# Altium project Z380-Z20X.PrjPcb
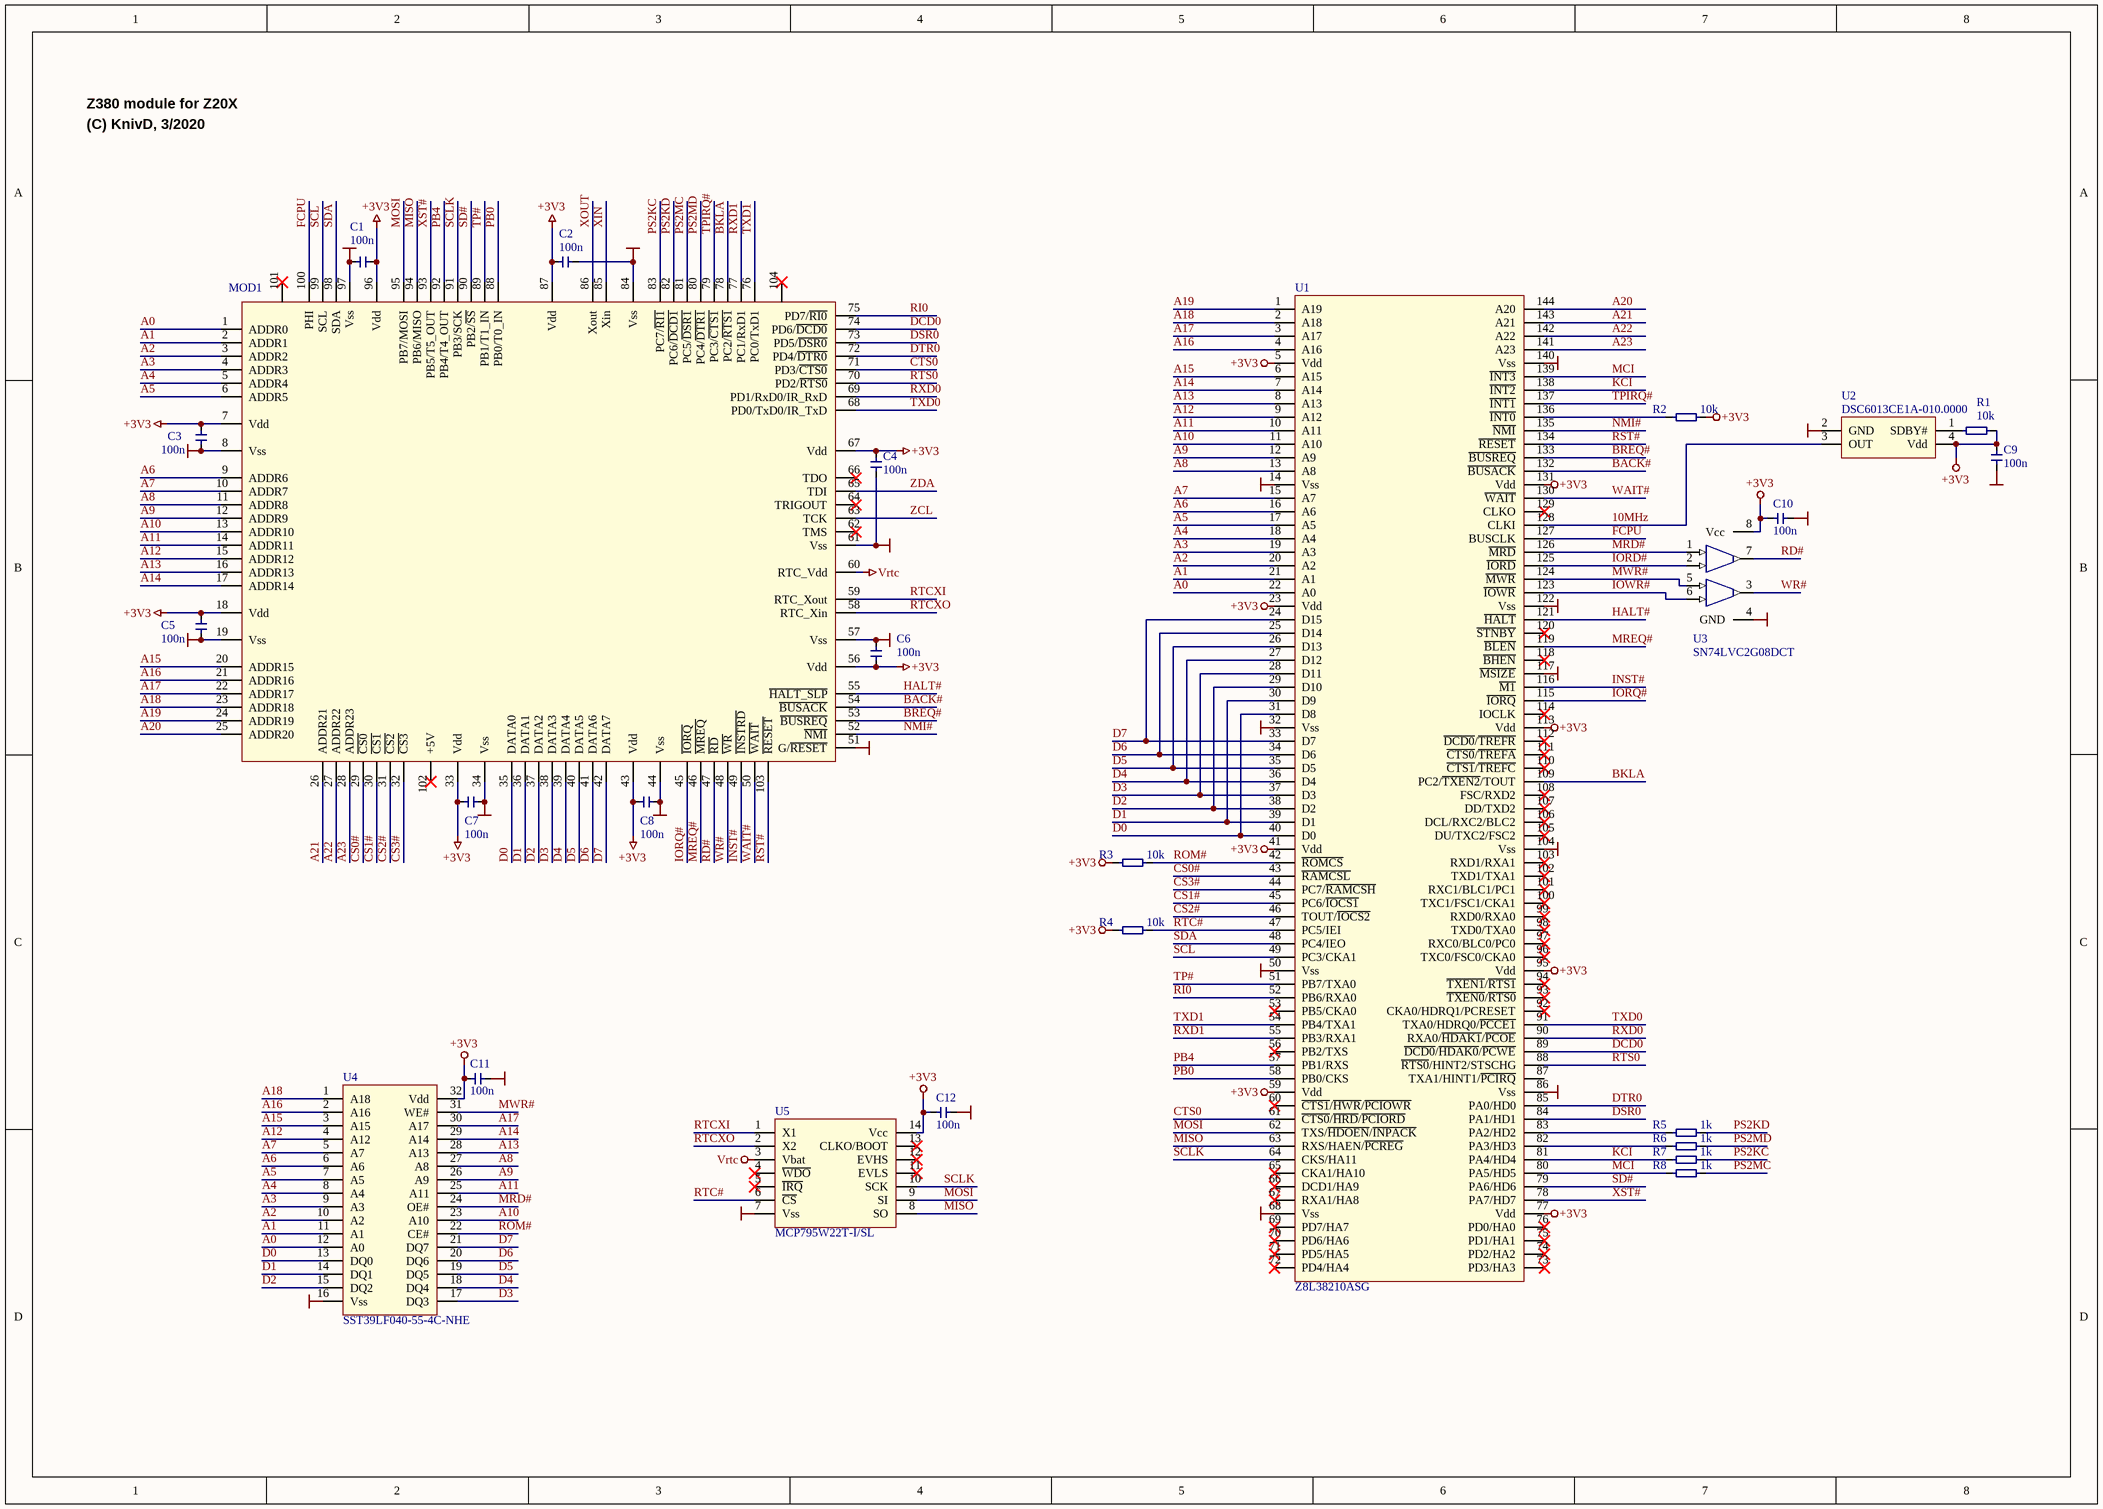
[diagram p0: main.SchDoc]
1 sheet, 26 parts. Net scope: global (net labels, ports and power ports of the same name join across sheets).
Board file: PCB.PcbDoc

## Sheet main.SchDoc: ELLO TROLL
size A3; Author: KnivD; DrawnBy: KnivD; Engineer: KnivD; DocumentNumber: 1; Revision: 1704; SheetNumber: 1; SheetTotal: 1; ProjectName: ELLO TROLL

### Parts
C1  100n  [_0805_CAP]
C2  100n  [_0805_CAP]
C3  100n  [_0805_CAP]
C4  100n  [_0805_CAP]
C5  100n  [_0805_CAP]
C6  100n  [_0805_CAP]
C7  100n  [_0805_CAP]
C8  100n  [_0805_CAP]
C9  100n  [_0805_CAP]
C10  100n  [_0805_CAP]
C11  100n  [_0805_CAP]
C12  100n  [_0805_CAP]
MOD1  Z20X CPU Module  [PGA100X15]  (value not drawn)
R1  10k  [_0805_RES]
R2  10k  [_0805_RES]
R3  10k  [_0805_RES]
R4  10k  [_0805_RES]
R5  1k  [_0805_RES]
R6  1k  [_0805_RES]
R7  1k  [_0805_RES]
R8  1k  [_0805_RES]
U1  Z8L38210ASG  [QFP50P2200X2200X170-144N]
U2  DSC6013CE1A-010.0000  [OSC_ABRACON_ASEMPC]
U3  SN74LVC2G08DCT  [SOP65P400X130-8N]
U4  SST39LF040-55-4C-NHE  [PLCC32-T/H socket]
U5  MCP795W22T-I/SL  [SOIC127P600X175-14N]

### Nets
+3V3: C1.1 C2.2 C3.1 C4.2 C5.1 C6.1 C7.1 C8.1 C9.2 C10.2 C11.2 C12.2 MOD1.7(Vdd) MOD1.18(Vdd) MOD1.33(Vdd) MOD1.43(Vdd) MOD1.56(Vdd) MOD1.67(Vdd) MOD1.87(Vdd) MOD1.96(Vdd) R1.2 R2.2 R3.2 R4.2 U1.5(Vdd) U1.23(Vdd) U1.41(Vdd) U1.59(Vdd) U1.77(Vdd) U1.95(Vdd) U1.113(Vdd) U1.131(Vdd) U2.4(Vdd) U3.8(Vcc) U4.32(Vdd) U5.14(Vcc)
GND: C1.2 C2.1 C3.2 C4.1 C5.2 C6.2 C7.2 C8.2 C9.1 C10.1 C11.1 C12.1 MOD1.8(Vss) MOD1.19(Vss) MOD1.34(Vss) MOD1.44(Vss) MOD1.51(G/~{RESET}) MOD1.57(Vss) MOD1.61(Vss) MOD1.84(Vss) MOD1.97(Vss) U1.14(Vss) U1.32(Vss) U1.50(Vss) U1.68(Vss) U1.86(Vss) U1.104(Vss) U1.117(~{MSIZE}) U1.122(Vss) U1.140(Vss) U2.2(GND) U3.4(GND) U4.16(Vss) U5.7(Vss)
Vrtc: MOD1.60(RTC_Vdd) U5.3(Vbat)
10MHz: U1.128(CLKI) U2.3(OUT)
A0: MOD1.1(ADDR0) U1.22(A0) U4.12(A0)
A1: MOD1.2(ADDR1) U1.21(A1) U4.11(A1)
A2: MOD1.3(ADDR2) U1.20(A2) U4.10(A2)
A3: MOD1.4(ADDR3) U1.19(A3) U4.9(A3)
A4: MOD1.5(ADDR4) U1.18(A4) U4.8(A4)
A5: MOD1.6(ADDR5) U1.17(A5) U4.7(A5)
A6: MOD1.9(ADDR6) U1.16(A6) U4.6(A6)
A7: MOD1.10(ADDR7) U1.15(A7) U4.5(A7)
A8: MOD1.11(ADDR8) U1.13(A8) U4.27(A8)
A9: MOD1.12(ADDR9) U1.12(A9) U4.26(A9)
A10: MOD1.13(ADDR10) U1.11(A10) U4.23(A10)
A11: MOD1.14(ADDR11) U1.10(A11) U4.25(A11)
A12: MOD1.15(ADDR12) U1.9(A12) U4.4(A12)
A13: MOD1.16(ADDR13) U1.8(A13) U4.28(A13)
A14: MOD1.17(ADDR14) U1.7(A14) U4.29(A14)
A15: MOD1.20(ADDR15) U1.6(A15) U4.3(A15)
A16: MOD1.21(ADDR16) U1.4(A16) U4.2(A16)
A17: MOD1.22(ADDR17) U1.3(A17) U4.30(A17)
A18: MOD1.23(ADDR18) U1.2(A18) U4.1(A18)
A19: MOD1.24(ADDR19) U1.1(A19)
A20: MOD1.25(ADDR20) U1.144(A20)
A21: MOD1.26(ADDR21) U1.143(A21)
A22: MOD1.27(ADDR22) U1.142(A22)
A23: MOD1.28(ADDR23) U1.141(A23)
BACK#: MOD1.54(~{BUSACK}) U1.132(~{BUSACK})
BKLA: MOD1.78(PC2/~{RTS1}) U1.109(PC2/~{TXEN2}/TOUT)
BREQ#: MOD1.53(~{BUSREQ}) U1.133(~{BUSREQ})
CS0#: MOD1.29(~{CS0}) U1.43(~{RAMCSL})
CS1#: MOD1.30(~{CS1}) U1.45(PC6/~{IOCS1})
CS2#: MOD1.31(~{CS2}) U1.46(TOUT/~{IOCS2})
CS3#: MOD1.32(~{CS3}) U1.44(PC7/~{RAMCSH})
CTS0: MOD1.71(PD3/~{CTS0}) U1.61(~{CTS0}/~{HRD}/~{PCIORD})
D0: MOD1.35(DATA0) U1.31(D8) U1.40(D0) U4.13(DQ0)
D1: MOD1.36(DATA1) U1.30(D9) U1.39(D1) U4.14(DQ1)
D2: MOD1.37(DATA2) U1.29(D10) U1.38(D2) U4.15(DQ2)
D3: MOD1.38(DATA3) U1.28(D11) U1.37(D3) U4.17(DQ3)
D4: MOD1.39(DATA4) U1.27(D12) U1.36(D4) U4.18(DQ4)
D5: MOD1.40(DATA5) U1.26(D13) U1.35(D5) U4.19(DQ5)
D6: MOD1.41(DATA6) U1.25(D14) U1.34(D6) U4.20(DQ6)
D7: MOD1.42(DATA7) U1.24(D15) U1.33(D7) U4.21(DQ7)
DCD0: MOD1.74(PD6/~{DCD0}) U1.89(~{DCD0}/~{HDAK0}/~{PCWE})
DSR0: MOD1.73(PD5/~{DSR0}) U1.84(PA1/HD1)
DTR0: MOD1.72(PD4/~{DTR0}) U1.85(PA0/HD0)
FCPU: MOD1.100(PHI) U1.127(BUSCLK)
HALT#: MOD1.55(~{HALT_SLP}) U1.121(~{HALT})
INST#: MOD1.49(~{INSTRD}) U1.116(~{M1})
IORD#: U1.125(~{IORD}) U3.2
IORQ#: MOD1.45(~{IORQ}) U1.115(~{IORQ})
IOWR#: U1.123(~{IOWR}) U3.6
KCI: R7.1 U1.81(PA4/HD4) U1.138(~{INT2})
MCI: R8.1 U1.80(PA5/HD5) U1.139(~{INT3})
MISO: MOD1.94(PB6/MISO) U1.63(RXS/HAEN/~{PCREG}) U5.8(SO)
MOSI: MOD1.95(PB7/MOSI) U1.62(TXS/~{HDOEN}/~{INPACK}) U5.9(SI)
MRD#: U1.126(~{MRD}) U3.1 U4.24(OE#)
MREQ#: MOD1.46(~{MREQ}) U1.119(~{BLEN})
MWR#: U1.124(~{MWR}) U3.5 U4.31(WE#)
NMI#: MOD1.52(~{NMI}) U1.135(~{NMI})
PB0: MOD1.88(PB0/T0_IN) U1.58(PB0/CKS)
PB4: MOD1.92(PB4/T4_OUT) U1.57(PB1/RXS)
PS2KC: MOD1.83(PC7/~{RI1}) R7.2
PS2KD: MOD1.82(PC6/~{DCD1}) R5.2
PS2MC: MOD1.81(PC5/~{DSR1}) R8.2
PS2MD: MOD1.80(PC4/~{DTR1}) R6.2
RD#: MOD1.47(~{RD}) U3.7
RI0: MOD1.75(PD7/~{RI0}) U1.52(PB6/RXA0)
ROM#: R3.1 U1.42(~{ROMCS}) U4.22(CE#)
RST#: MOD1.103(~{RESET}) U1.134(~{RESET})
RTC#: R4.1 U1.47(PC5/IEI) U5.6(~{CS})
RTCXI: MOD1.59(RTC_Xout) U5.1(X1)
RTCXO: MOD1.58(RTC_Xin) U5.2(X2)
RTS0: MOD1.70(PD2/~{RTS0}) U1.88(~{RTS}~{0}/HINT2/STSCHG)
RXD0: MOD1.69(PD1/RxD0/IR_RxD) U1.90(RXA0/~{HDAK1}/~{PCOE})
RXD1: MOD1.77(PC1/RxD1) U1.55(PB3/RXA1)
SCL: MOD1.99(SCL) U1.49(PC3/CKA1)
SCLK: MOD1.91(PB3/SCK) U1.64(CKS/HA11) U5.10(SCK)
SD#: MOD1.90(PB2/~{SS}) U1.79(PA6/HD6)
SDA: MOD1.98(SDA) U1.48(PC4/IEO)
TP#: MOD1.89(PB1/T1_IN) U1.51(PB7/TXA0)
TPIRQ#: MOD1.79(PC3/~{CTS1}) U1.137(~{INT1})
TXD0: MOD1.68(PD0/TxD0/IR_TxD) U1.91(TXA0/HDRQ0/~{PCCE1})
TXD1: MOD1.76(PC0/TxD1) U1.54(PB4/TXA1)
WAIT#: MOD1.50(~{WAIT}) U1.130(~{WAIT})
WR#: MOD1.48(~{WR}) U3.3
XIN: MOD1.85(Xin)
XOUT: MOD1.86(Xout)
XST#: MOD1.93(PB5/T5_OUT) U1.78(PA7/HD7)
ZCL: MOD1.63(TCK)
ZDA: MOD1.65(TDI)
NetR1_1: R1.1 U2.1(SDBY#)
NetR2_1: R2.1 U1.136(~{INT0})
NetR5_1: R5.1 U1.83(PA2/HD2)
NetR6_1: R6.1 U1.82(PA3/HD3)

Not connected (* = marked no-connect by the designer): MOD1 62(TMS)* 64(TRIGOUT)* 66(TDO)* 101* 102(+5V)* 104*; U1 53(PB5/CKA0)* 56(PB2/TXS)* 60(~{CTS1}/~{HWR}/~{PCIOWR})* 65(CKA1/HA10)* 66(DCD1/HA9)* 67(RXA1/HA8)* 69(PD7/HA7)* 70(PD6/HA6)* 71(PD5/HA5)* 72(PD4/HA4)* 73(PD3/HA3)* 74(PD2/HA2)* 75(PD1/HA1)* 76(PD0/HA0)* 87(TXA1/HINT1/~{PCIRQ}) 92(CKA0/HDRQ1/PCRESET)* 93(~{TXEN0}/~{RTS0})* 94(~{TXEN1}/~{RTS1})* 96(TXC0/FSC0/CKA0)* 97(RXC0/BLC0/PC0)* 98(TXD0/TXA0)* 99(RXD0/RXA0)* 100(TXC1/FSC1/CKA1)* 101(RXC1/BLC1/PC1)* 102(TXD1/TXA1)* 103(RXD1/RXA1)* 105(DU/TXC2/FSC2)* 106(DCL/RXC2/BLC2)* 107(DD/TXD2)* 108(FSC/RXD2)* 110(~{CTS1}/~{TREFC})* 111(~{CTS0}/~{TREFA})* 112(~{DCD0}/~{TREFR})* 114(IOCLK)* 118(~{BHEN})* 120(~{STNBY})* 129(CLKO)*; U5 4(~{WDO})* 5(~{IRQ})* 11(EVLS)* 12(EVHS)* 13(CLKO/BOOT)*

### Notes on the sheet
- Z380 module for Z20X
- (C) KnivD, 3/2020

### Library data of the parts
C1-C12 = Capacitor
R1-R8 = Resistor
U1 = Z8x382: High-Performance Data Communication Processor; Manufacturer: Zilog; Variant: Z80382 (5V/20MHz); Z8L382 (3.3V/10MHz)
U2 = DSC1033: Low-Power CMOS Oscillator; Manufacturer: Microchip
U3 = SN74xxx2G08: DUAL 2-INPUT AND GATE; Manufacturer: Texas Instruments; Package: DCT (SSOP65); Package: DCU (SSOP50)
U4 = SST39LF/VF040 (PLCC): 512Kx8 CMOS Multi-Purpose Flash; Manufacturer: Microchip
U5 = MCP795: SPI Real-Time Clock Calendar with  Enhanced Features and Battery Switchover; Manufacturer: Microchip